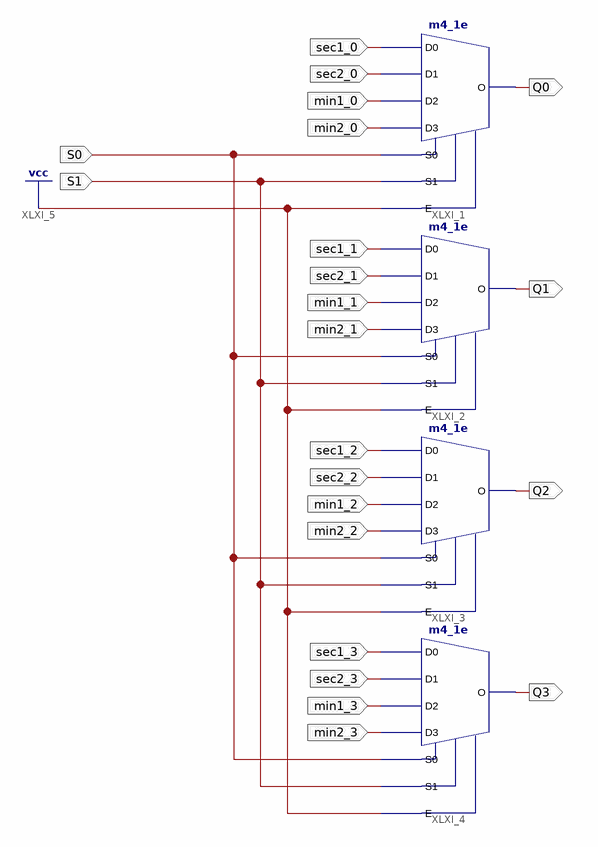
[diagram p0: schematic sheet 1]
// Xilinx ISE schematic Mux4_1.sch (spartan6) as structural Verilog: 4 symbols, 22 ports
module Mux4_1 (
  input  sec1_0,
  input  sec2_0,
  input  min1_0,
  input  min2_0,
  input  sec1_1,
  input  sec2_1,
  input  min1_1,
  input  min2_1,
  input  sec1_2,
  input  sec2_2,
  input  min1_2,
  input  min2_2,
  input  sec1_3,
  input  sec2_3,
  input  min1_3,
  input  min2_3,
  input  S0,
  input  S1,
  output Q0,
  output Q1,
  output Q2,
  output Q3
);

  m4_1e XLXI_1 (.D0(sec1_0), .D1(sec2_0), .D2(min1_0), .D3(min2_0), .E(1'b1), .S0(S0), .S1(S1), .O(Q0));
  m4_1e XLXI_2 (.D0(sec1_1), .D1(sec2_1), .D2(min1_1), .D3(min2_1), .E(1'b1), .S0(S0), .S1(S1), .O(Q1));
  m4_1e XLXI_3 (.D0(sec1_2), .D1(sec2_2), .D2(min1_2), .D3(min2_2), .E(1'b1), .S0(S0), .S1(S1), .O(Q2));
  m4_1e XLXI_4 (.D0(sec1_3), .D1(sec2_3), .D2(min1_3), .D3(min2_3), .E(1'b1), .S0(S0), .S1(S1), .O(Q3));
endmodule
